# EAGLE design nfc_for_discovery (EAGLE 7.2.0)
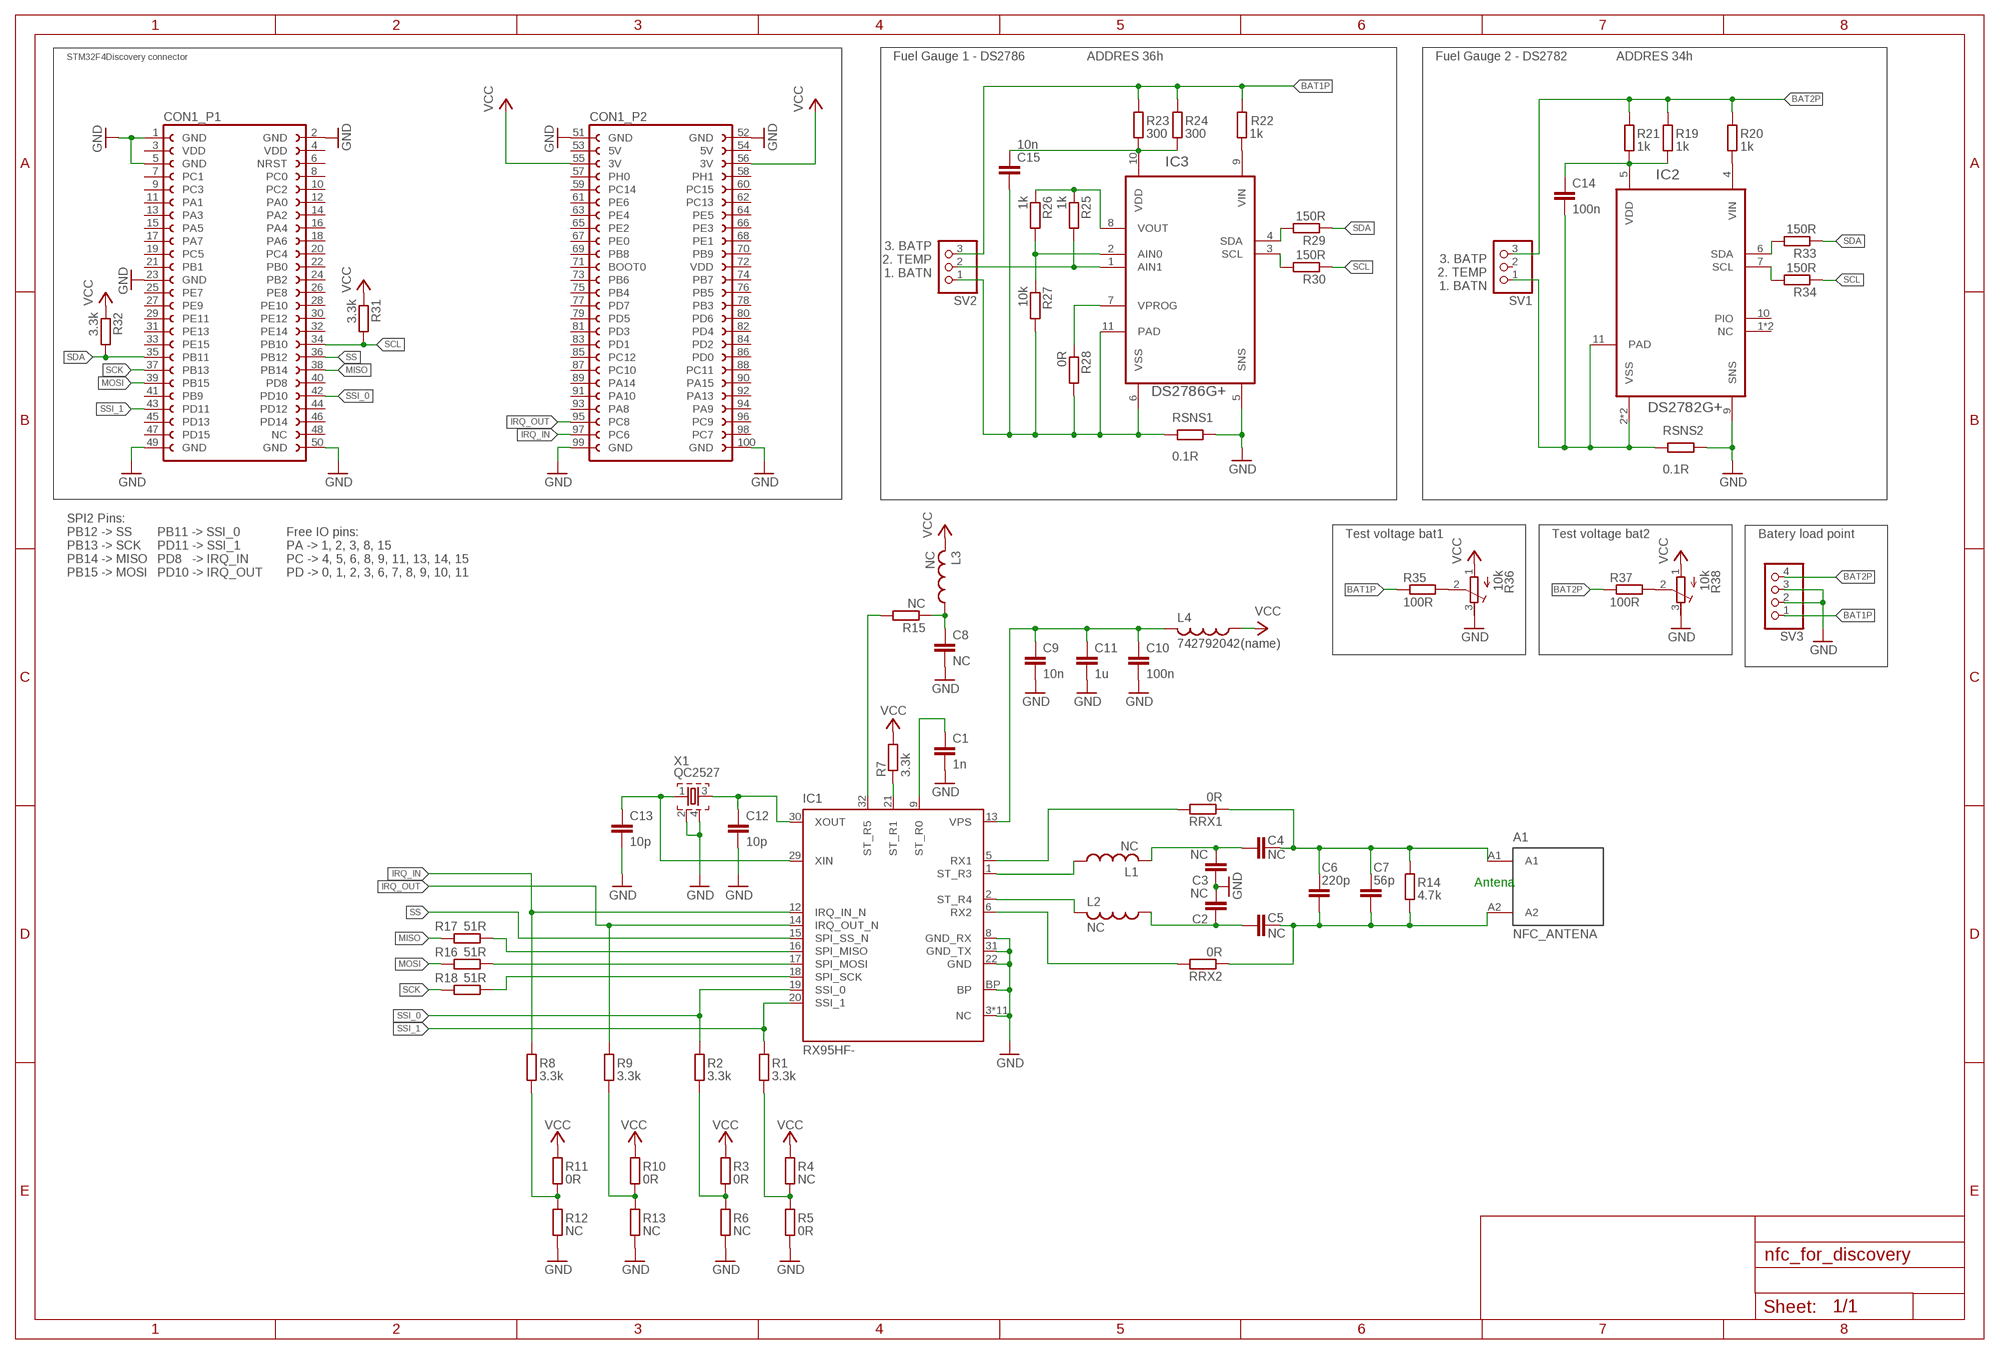
[diagram p0: schematic, sheet 1]

## Parts
A1  NFC_ANTENA  [NFC_ANTENA]
C1  1n  C-EUC0603  [C0603]
C2  NC  C-EUC0603  [C0603]
C3  NC  C-EUC0603  [C0603]
C4  NC  C-EUC0603  [C0603]
C5  NC  C-EUC0603  [C0603]
C6  220p  C-EUC0603  [C0603]
C7  56p  C-EUC0603  [C0603]
C8  NC  C-EUC0603  [C0603]
C9  10n  C-EUC0603  [C0603]
C10  100n  C-EUC0603  [C0603]
C11  1u  C-EUC0603K  [C0603K]
C12  10p  C-EUC0603  [C0603]
C13  10p  C-EUC0603  [C0603]
C14  100n  C-EUC0603  [C0603]
C15  10n  C-EUC0603  [C0603]
CON1  STM32F4DISCOVERY-CONNECTOR  [STM32F4DISCOVERY_CONNECTOR]
IC1  RX95HF-  [VFQFPN32]
IC2  DS2782G+  [DFN300X400]
IC3  DS2786G+  [DFN300X300X80-11N]
L1  NC  L-USL2012C  [L2012C]
L2  NC  L-USL2012C  [L2012C]
L3  NC  L-USL2012C  [L2012C]
L4  742792042(name)  L-USL2012C  [L2012C]
R1  3.3k  R-EU_R0603  [R0603]
R2  3.3k  R-EU_R0603  [R0603]
R3  0R  R-EU_R0603  [R0603]
R4  NC  R-EU_R0603  [R0603]
R5  0R  R-EU_R0603  [R0603]
R6  NC  R-EU_R0603  [R0603]
R7  3.3k  R-EU_R0603  [R0603]
R8  3.3k  R-EU_R0603  [R0603]
R9  3.3k  R-EU_R0603  [R0603]
R10  0R  R-EU_R0603  [R0603]
R11  0R  R-EU_R0603  [R0603]
R12  NC  R-EU_R0603  [R0603]
R13  NC  R-EU_R0603  [R0603]
R14  4.7k  R-EU_R0603  [R0603]
R15  NC  R-EU_R0603  [R0603]
R16  51R  R-EU_R0603  [R0603]
R17  51R  R-EU_R0603  [R0603]
R18  51R  R-EU_R0603  [R0603]
R19  1k  R-EU_R0603  [R0603]
R20  1k  R-EU_R0603  [R0603]
R21  1k  R-EU_R0603  [R0603]
R22  1k  R-EU_R0603  [R0603]
R23  300  R-EU_R0603  [R0603]
R24  300  R-EU_R0603  [R0603]
R25  1k  R-EU_R0603  [R0603]
R26  1k  R-EU_R0603  [R0603]
R27  10k  R-EU_R0603  [R0603]
R28  0R  R-EU_R0603  [R0603]
R29  150R  R-EU_R0603  [R0603]
R30  150R  R-EU_R0603  [R0603]
R31  3.3k  R-EU_R0603  [R0603]
R32  3.3k  R-EU_R0603  [R0603]
R33  150R  R-EU_R0603  [R0603]
R34  150R  R-EU_R0603  [R0603]
R35  100R  R-EU_R0603  [R0603]
R36  10k  R-TRIMM4G/J  [RTRIM4G/J]
R37  100R  R-EU_R0603  [R0603]
R38  10k  R-TRIMM4G/J  [RTRIM4G/J]
RRX1  0R  R-EU_R0603  [R0603]
RRX2  0R  R-EU_R0603  [R0603]
RSNS1  0.1R  R-EU_R0603  [R0603]
RSNS2  0.1R  R-EU_R0603  [R0603]
SV1  PINHD-1X3/90  [1X03/90]
SV2  PINHD-1X3/90  [1X03/90]
SV3  PINHD-1X4/90  [1X04/90]
X1  QC2527  [QC2527]

## Nets
BAT1N: C15.2 IC3.6(VSS) IC3.11(PAD) R27.2 R28.2 RSNS1.2 SV2.1
BAT1P: R22.1 R23.1 R24.1 R35.1 SV2.3 SV3.1
BAT2N: C14.2 IC2.2(VSS) IC2.3(VSS) IC2.11(PAD) RSNS2.2 SV1.1
BAT2P: R19.1 R20.1 R21.1 R37.1 SV1.3 SV3.4
GND: C1.1 C2.2 C3.1 C8.2 C9.2 C10.2 C11.2 C12.2 C13.2 CON1.1(_P1:GND) CON1.2(_P1:GND) CON1.5(_P1:GND) CON1.23(_P1:GND) CON1.49(_P1:GND) CON1.50(_P1:GND) CON1.51(_P2:GND) CON1.52(_P2:GND) CON1.99(_P2:GND) CON1.100(_P2:GND) IC1.3(NC) IC1.4(NC) IC1.7(NC) IC1.8(GND_RX) IC1.10(NC) IC1.11(NC) IC1.22(GND) IC1.23(NC) IC1.24(NC) IC1.25(NC) IC1.26(NC) IC1.27(NC) IC1.28(NC) IC1.31(GND_TX) IC1.BP IC2.9(SNS) IC3.5(SNS) R5.1 R6.1 R12.1 R13.1 R36.3(E) R38.3(E) RSNS1.1 RSNS2.1 SV3.2 SV3.3 X1.2 X1.4
IRQ_IN: CON1.97(_P2:PC6) IC1.12(IRQ_IN_N) R8.2
IRQ_OUT: CON1.95(_P2:PC8) IC1.14(IRQ_OUT_N) R9.2
MISO: CON1.38(_P1:PB14) R17.2
MOSI: CON1.39(_P1:PB15) R16.2
N$1: C14.1 IC2.5(VDD) R19.2 R21.2
N$2: IC1.16(SPI_MISO) R17.1
N$3: IC1.17(SPI_MOSI) R16.1
N$4: IC1.18(SPI_SCK) R18.1
N$5: IC2.4(VIN) R20.2
N$6: IC3.4(SDA) R29.2
N$8: IC3.3(SCL) R30.2
N$9: R1.1 R4.1 R5.2
N$10: R2.1 R3.1 R6.2
N$11: C2.1 C5.2 L2.1
N$12: IC1.21(ST_R1) R7.1
N$13: C1.2 IC1.9(ST_R0)
N$14: R8.1 R11.1 R12.2
N$15: R9.1 R10.1 R13.2
N$16: C3.2 C4.2 L1.2
N$17: A1.A1 C4.1 C6.2 C7.2 R14.1 RRX1.1
N$18: A1.A2 C5.1 C6.1 C7.1 R14.2 RRX2.1
N$19: IC1.6(RX2) RRX2.2
N$20: IC1.5(RX1) RRX1.2
N$21: IC1.1(ST_R3) L1.1
N$22: IC1.2(ST_R4) L2.2
N$23: IC1.32(ST_R5) R15.2
N$24: C8.1 L3.1 R15.1
N$25: C9.1 C10.1 C11.1 IC1.13(VPS) L4.2
N$26: IC3.9(VIN) R22.2
N$27: C12.1 IC1.30(XOUT) X1.3
N$28: C13.1 IC1.29(XIN) X1.1
N$29: C15.1 IC3.10(VDD) R23.2 R24.2
N$30: IC2.6(SDA) R33.2
N$32: IC2.7(SCL) R34.2
N$33: IC3.2(AIN0) R26.2 R27.1
N$34: IC3.1(AIN1) R25.2 SV2.2
N$35: IC3.8(VOUT) R25.1 R26.1
N$36: IC3.7(VPROG) R28.1
N$37: R35.2 R36.2(S)
N$38: R37.2 R38.2(S)
SCK: CON1.37(_P1:PB13) R18.2
SCL: CON1.34(_P1:PB10) R30.1 R31.2 R34.1
SDA: CON1.35(_P1:PB11) R29.1 R32.2 R33.1
SS: CON1.36(_P1:PB12) IC1.15(SPI_SS_N)
SSI_0: CON1.42(_P1:PD10) IC1.19(SSI_0) R2.2
SSI_1: CON1.43(_P1:PD11) IC1.20(SSI_1) R1.2
VCC: CON1.55(_P2:3V) CON1.56(_P2:3V) L3.2 L4.1 R3.2 R4.2 R7.2 R10.2 R11.2 R31.1 R32.1 R36.1(A) R38.1(A)
Unconnected: CON1.3(_P1:VDD) CON1.4(_P1:VDD) CON1.6(_P1:NRST) CON1.7(_P1:PC1) CON1.8(_P1:PC0) CON1.9(_P1:PC3) CON1.10(_P1:PC2) CON1.11(_P1:PA1) CON1.12(_P1:PA0) CON1.13(_P1:PA3) CON1.14(_P1:PA2) CON1.15(_P1:PA5) CON1.16(_P1:PA4) CON1.17(_P1:PA7) CON1.18(_P1:PA6) CON1.19(_P1:PC5) CON1.20(_P1:PC4) CON1.21(_P1:PB1) CON1.22(_P1:PB0) CON1.24(_P1:PB2) CON1.25(_P1:PE7) CON1.26(_P1:PE8) CON1.27(_P1:PE9) CON1.28(_P1:PE10) CON1.29(_P1:PE11) CON1.30(_P1:PE12) CON1.31(_P1:PE13) CON1.32(_P1:PE14) CON1.33(_P1:PE15) CON1.40(_P1:PD8) CON1.41(_P1:PB9) CON1.44(_P1:PD12) CON1.45(_P1:PD13) CON1.46(_P1:PD14) CON1.47(_P1:PD15) CON1.48(_P1:NC) CON1.53(_P2:5V) CON1.54(_P2:5V) CON1.57(_P2:PH0) CON1.58(_P2:PH1) CON1.59(_P2:PC14) CON1.60(_P2:PC15) CON1.61(_P2:PE6) CON1.62(_P2:PC13) CON1.63(_P2:PE4) CON1.64(_P2:PE5) CON1.65(_P2:PE2) CON1.66(_P2:PE3) CON1.67(_P2:PE0) CON1.68(_P2:PE1) CON1.69(_P2:PB8) CON1.70(_P2:PB9) CON1.71(_P2:BOOT0) CON1.72(_P2:VDD) CON1.73(_P2:PB6) CON1.74(_P2:PB7) CON1.75(_P2:PB4) CON1.76(_P2:PB5) CON1.77(_P2:PD7) CON1.78(_P2:PB3) CON1.79(_P2:PD5) CON1.80(_P2:PD6) CON1.81(_P2:PD3) CON1.82(_P2:PD4) CON1.83(_P2:PD1) CON1.84(_P2:PD2) CON1.85(_P2:PC12) CON1.86(_P2:PD0) CON1.87(_P2:PC10) CON1.88(_P2:PC11) CON1.89(_P2:PA14) CON1.90(_P2:PA15) CON1.91(_P2:PA10) CON1.92(_P2:PA13) CON1.93(_P2:PA8) CON1.94(_P2:PA9) CON1.96(_P2:PC9) CON1.98(_P2:PC7) IC2.1(NC) IC2.8(NC) IC2.10(PIO) SV1.2

## Notes on the sheet
- STM32F4Discovery connector | Fuel Gauge 1 - DS2786 | ADDRES 36h | Fuel Gauge 2 - DS2782 | ADDRES 34h
- 3. BATP
  2. TEMP
  1. BATN
- 3. BATP
  2. TEMP
  1. BATN
- Test voltage bat1 | Test voltage bat2 | Batery load point
- SPI2 Pins:
  PB12 -> SS
  PB13 -> SCK
  PB14 -> MISO
  PB15 -> MOSI
- PB11 -> SSI_0
  PD11 -> SSI_1
  PD8   -> IRQ_IN
  PD10 -> IRQ_OUT
- Free IO pins:
  PA -> 1, 2, 3, 8, 15
  PC -> 4, 5, 6, 8, 9, 11, 13, 14, 15
  PD -> 0, 1, 2, 3, 6, 7, 8, 9, 10, 11
- Antena

## Library data of the parts
A1 = NFC_antena_for_RX59HF:NFC_ANTENA
C1-C15 = rcl:C-EU: CAPACITOR, European symbol
CON1 = stm32f4Discovery_connector:STM32F4DISCOVERY-CONNECTOR
IC1 = RX95HF:RX95HF
IC2 = DS278x:DS2782G+
IC3 = DS278x:DS2786G+; DESCRIPTION: Stand-Alone OCV-Based Fuel Gauge; MPN: DS2786; PACKAGE: DFN-10; SUPPLIER: Maxim
L1-L4 = rcl:L-US: INDUCTOR, American symbol
R1-R35 R37 RRX1 RRX2 RSNS1 RSNS2 = rcl:R-EU_: RESISTOR, European symbol
R36 R38 = rcl:R-TRIMM: Trimm resistor
SV1 SV2 = pinhead:PINHD-1X3: PIN HEADER
SV3 = pinhead:PINHD-1X4: PIN HEADER
X1 = QCxxxx:QC2527

## Board
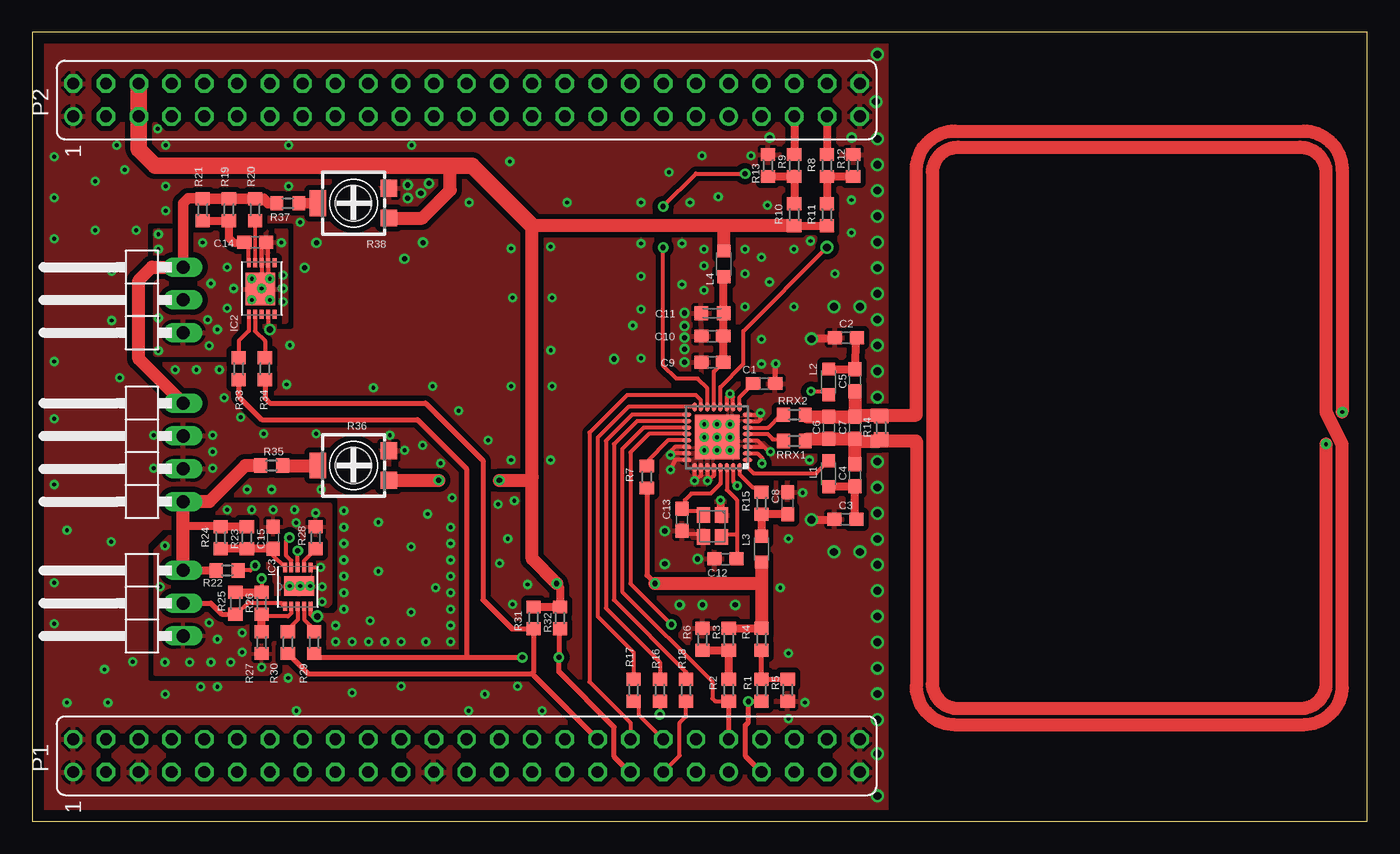
[diagram p1: board, top side]
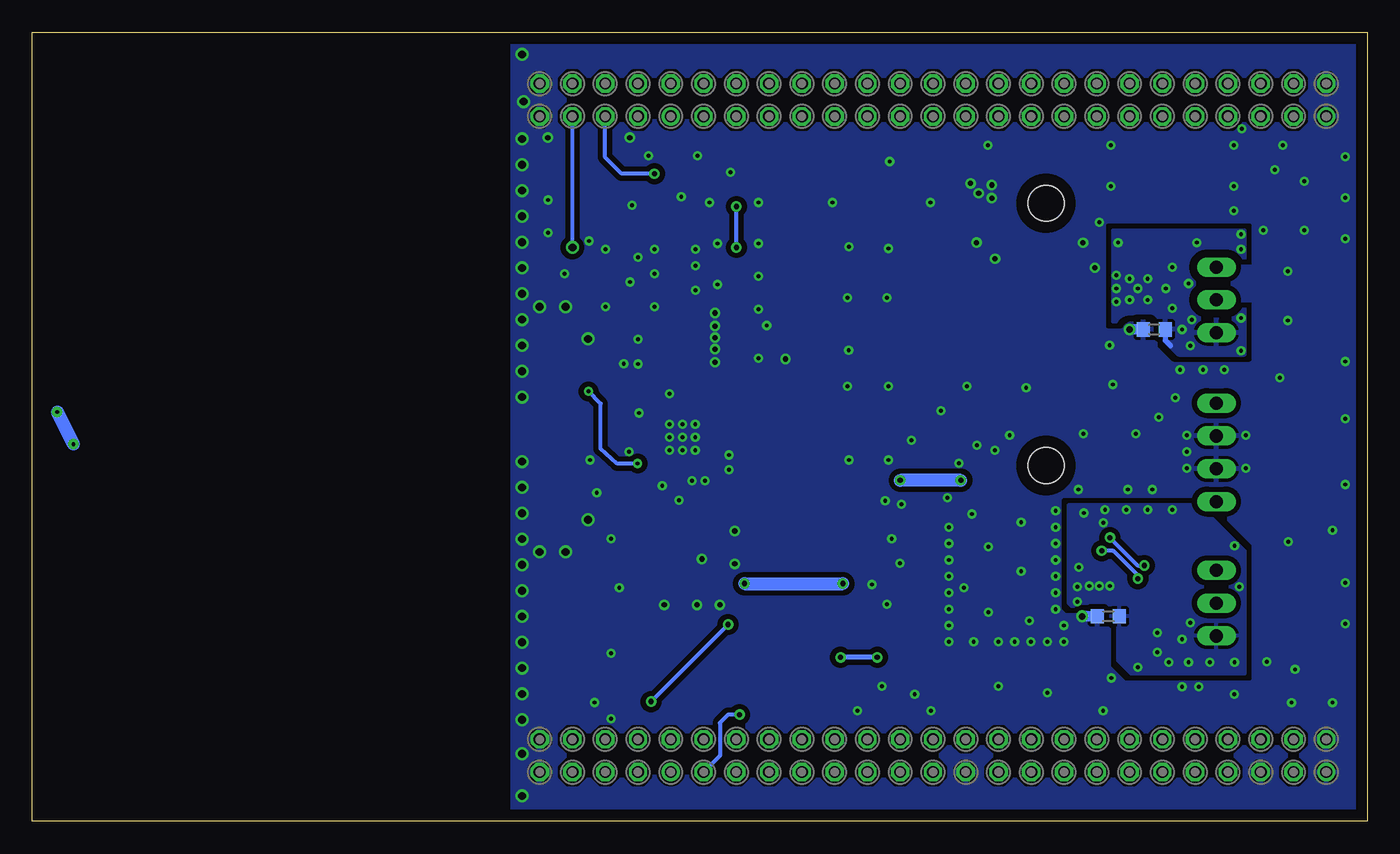
[diagram p2: board, bottom side, seen from below]

Size 103.46 x 61.12 mm. Coordinates in mm from the lower left corner, seen from the top.
Outline: 0,0 103.46,0 103.46,61.12 0,61.12 0,0
Copper layers (1*16): Top 0.035mm / dielectric 1.5mm / Bottom 0.035mm
Design rules "default *": minimum track width 8mil, minimum drill 0.3mm, track to track 4mil, track to pad 4mil, pad to pad 4mil, via to via 4mil, smd to smd 0mil, copper to edge 35mil, drill to drill 8mil, minimum pad ring 10mil, minimum via ring 8mil, stop-mask expansion 4mil, vias tented up to drill 0mil, thermal gap 10mil
Holes 2.8 mm at 24.89,47.88 24.89,27.56

### Footprints (pad centres in the part's own frame; a part is rotated, then mirrored left to right if it is on the bottom)
NFC_ANTENA = smd 1.27 x 1 bottom: A1 0.237,1.025; A2 0.237,-0.988 | drill 0.3: P$3 34.862,1.262; P$4 36.125,-1.225
C0603 = smd 1.1 x 1: 1 -0.85,0; 2 0.85,0
C0603K = smd 1.05 x 1.08: 1 -0.875,0; 2 0.875,0
STM32F4DISCOVERY_CONNECTOR = drill 0.914: 1 -1.27,30.48; 41 -1.27,-20.32; 51 49.53,30.48; 91 49.53,-20.32 | drill 0.914 octagon: 2 1.27,30.48; 3 -1.27,27.94; 4 1.27,27.94; 5 -1.27,25.4; 6 1.27,25.4; 7 -1.27,22.86; 8 1.27,22.86; 9 -1.27,20.32; 10 1.27,20.32; 11 -1.27,17.78; 12 1.27,17.78; 13 -1.27,15.24; 14 1.27,15.24; 15 -1.27,12.7; 16 1.27,12.7; 17 -1.27,10.16; 18 1.27,10.16; 19 -1.27,7.62; 20 1.27,7.62; 21 -1.27,5.08; 22 1.27,5.08; 23 -1.27,2.54; 24 1.27,2.54; 25 -1.27,0; 26 1.27,0; 27 -1.27,-2.54; 28 1.27,-2.54; 29 -1.27,-5.08; 30 1.27,-5.08; 31 -1.27,-7.62; 32 1.27,-7.62; 33 -1.27,-10.16; 34 1.27,-10.16; 35 -1.27,-12.7; 36 1.27,-12.7; 37 -1.27,-15.24; 38 1.27,-15.24; 39 -1.27,-17.78; 40 1.27,-17.78; 42 1.27,-20.32; 43 -1.27,-22.86; 44 1.27,-22.86; 45 -1.27,-25.4; 46 1.27,-25.4; 47 -1.27,-27.94; 48 1.27,-27.94; 49 -1.27,-30.48; 50 1.27,-30.48; 52 52.07,30.48; 53 49.53,27.94; 54 52.07,27.94; 55 49.53,25.4; 56 52.07,25.4; 57 49.53,22.86; 58 52.07,22.86; 59 49.53,20.32; 60 52.07,20.32; 61 49.53,17.78; 62 52.07,17.78; 63 49.53,15.24; 64 52.07,15.24; 65 49.53,12.7; 66 52.07,12.7; 67 49.53,10.16; 68 52.07,10.16; 69 49.53,7.62; 70 52.07,7.62; 71 49.53,5.08; 72 52.07,5.08; 73 49.53,2.54; 74 52.07,2.54; 75 49.53,0; 76 52.07,0; 77 49.53,-2.54; 78 52.07,-2.54; 79 49.53,-5.08; 80 52.07,-5.08; 81 49.53,-7.62; 82 52.07,-7.62; 83 49.53,-10.16; 84 52.07,-10.16; 85 49.53,-12.7; 86 52.07,-12.7; 87 49.53,-15.24; 88 52.07,-15.24; 89 49.53,-17.78; 90 52.07,-17.78; 92 52.07,-20.32; 93 49.53,-22.86; 94 52.07,-22.86; 95 49.53,-25.4; 96 52.07,-25.4; 97 49.53,-27.94; 98 52.07,-27.94; 99 49.53,-30.48; 100 52.07,-30.48
VFQFPN32 = smd 0.7 x 0.3: 1 -2.35,1.75; 2 -2.35,1.25; 3 -2.35,0.75; 4 -2.35,0.25; 5 -2.35,-0.25; 6 -2.35,-0.75; 7 -2.35,-1.25; 8 -2.35,-1.75; 17 2.35,-1.75; 18 2.35,-1.25; 19 2.35,-0.75; 20 2.35,-0.25; 21 2.35,0.25; 22 2.35,0.75; 23 2.35,1.25; 24 2.35,1.75 | smd 0.3 x 0.7: 9 -1.75,-2.35; 10 -1.25,-2.35; 11 -0.75,-2.35; 12 -0.25,-2.35; 13 0.25,-2.35; 14 0.75,-2.35; 15 1.25,-2.35; 16 1.75,-2.35; 25 1.75,2.35; 26 1.25,2.35; 27 0.75,2.35; 28 0.25,2.35; 29 -0.25,2.35; 30 -0.75,2.35; 31 -1.25,2.35; 32 -1.75,2.35 | smd 3.45 x 3.45: BP 0,0
DFN300X400 = smd 0.711 x 0.305: 1 -1.999,0.991; 2 -1.999,0.508; 3 -1.999,0; 4 -1.999,-0.508; 5 -1.999,-0.991; 6 1.999,-0.991; 7 1.999,-0.508; 8 1.999,0; 9 1.999,0.508; 10 1.999,0.991 | smd 2.499 x 2.311: 11 0.051,-0.102
DFN300X300X80-11N = smd 0.711 x 0.305: 1 -1.499,0.991; 2 -1.499,0.508; 3 -1.499,0; 4 -1.499,-0.508; 5 -1.499,-0.991; 6 1.499,-0.991; 7 1.499,-0.508; 8 1.499,0; 9 1.499,0.508; 10 1.499,0.991 | smd 1.499 x 2.311: 11 0.051,-0.102
L2012C = smd 1 x 1: 1 -1,0; 2 1,0
R0603 = smd 1 x 1.1: 1 -0.85,0; 2 0.85,0
RTRIM4G/J = smd 1.3 x 1.3: 1 -1.15,-2.75; 3 1.15,-2.75 | smd 2 x 1.3: 2 0,2.75
1X03/90 = drill 1.016 long: 1 -2.54,-3.81; 2 0,-3.81; 3 2.54,-3.81
1X04/90 = drill 1.016 long: 1 -3.81,-3.81; 2 -1.27,-3.81; 3 1.27,-3.81; 4 3.81,-3.81
QC2527 = smd 1.2 x 1: 1 -0.85,-0.7; 2 0.85,-0.7; 3 0.85,0.7; 4 -0.85,0.7

### Placement (x,y rotation side)
A1  65.41,30.48 180 bottom
C1  56.72,33.91 180 top
C2  63.06,37.46 180 top
C3  63.02,23.39 0 top
C4  63.75,26.8 270 top
C5  63.75,34.16 90 top
C6  61.72,30.48 270 top
C7  63.75,30.48 270 top
C8  58.55,24.64 90 top
C9  52.7,35.56 180 top
C10  52.7,37.59 180 top
C11  52.7,39.37 180 top
C12  53.72,20.32 180 top
C13  50.35,23.35 270 top
C14  17.29,44.85 0 top
C15  18.67,21.97 90 top
CON1  33.66,5.08 90 top
IC1  53.08,29.75 180 top
IC2  17.78,41.27 270 top
IC3  20.57,18.16 90 top
L1  61.72,26.92 270 top
L2  61.72,34.04 270 top
L3  56.52,21.08 270 top
L4  53.59,43.18 270 top
R1  56.52,10.16 270 top
R2  53.98,10.16 270 top
R3  53.98,14.1 90 top
R4  56.52,14.1 90 top
R5  58.55,10.16 90 top
R6  51.94,14.1 270 top
R7  47.62,26.67 270 top
R8  61.59,50.8 90 top
R9  59.05,50.8 90 top
R10  59.05,46.99 270 top
R11  61.59,46.99 270 top
R12  63.63,50.8 270 top
R13  57.02,50.8 270 top
R14  65.79,30.48 90 top
R15  56.52,24.64 90 top
R16  48.64,10.16 270 top
R17  46.61,10.16 270 top
R18  50.67,10.16 270 top
R19  15.24,47.37 270 top
R20  17.27,47.37 270 top
R21  13.21,47.37 270 top
R22  15.11,19.43 0 top
R23  16.64,21.97 270 top
R24  14.61,21.97 270 top
R25  15.75,16.89 270 top
R26  17.78,16.89 270 top
R27  17.78,13.84 270 top
R28  21.97,21.97 90 top
R29  21.84,13.84 90 top
R30  19.81,13.84 90 top
R31  38.86,15.75 270 top
R32  40.89,15.75 270 top
R33  16,35.05 90 top
R34  18.03,35.05 90 top
R35  18.54,27.56 0 top
R36  24.89,27.56 90 top
R37  19.81,47.88 0 top
R38  24.89,47.88 90 top
RRX1  59.05,29.46 180 top
RRX2  59.05,31.5 180 top
RSNS1  20.07,15.88 0 bottom
RSNS2  16.51,38.1 0 bottom
SV1  7.87,40.39 90 top
SV2  7.87,16.89 90 top
SV3  7.87,28.57 90 top
X1  52.7,22.86 270 top

### Tracks (layer width: path | path; a pad name or v marks a point on that pad's centre or on a via)
BAT1N  (via drill 0.3)
  Top 0.305: v21.55,18.23 21.61,18.23 21.64,18.26 | IC3.6 22.33,19.66 v22.35,19.68
  other vias: 18.67,24.13 20.75,18.23 19.95,18.23 21.97,23.88 22.48,18.16 22.48,17.02 16.26,13.08 17.78,11.94 15.11,24.13 17.02,24.13 20.32,24.13 20.45,23.11 10.29,12.32 12.19,12.32 15.37,12.32 9.91,18.16 10.29,21.34 13.72,15.37 14.35,14.1 13.84,12.32 16.26,14.61
  pour Top (isolate 0.406): 23.11,24.51 13.08,24.51 9.53,20.95 9.53,11.43 18.29,11.43 19.3,12.45 19.3,14.99 20.57,16.26 22.48,16.26 23.11,16.89
  pour Bottom (isolate 0.406): 23.11,24.51 13.08,24.51 9.53,20.95 9.53,11.43 18.29,11.43 19.3,12.45 19.3,14.99 20.57,16.26 22.48,16.26 23.11,16.89
BAT1P
  Top 0.61: R23.1 R24.1 14.57,22.86 11.68,22.86 | SV2.3 R22.1
  Top 1.016: SV2.3 11.68,22.86 SV3.1 13.72,24.77 16.51,27.56 R35.1
BAT2N  (via drill 0.3)
  Top 0.305: 17.78,42.04 IC2.3 17.78,45.09 | 17.78,41.91 17.78,42.04 | 17.78,42.04 v18.41,42.04 18.29,42.04 IC2.2 18.29,45.09 18.41,45.09
  Bottom 0.406: RSNS2.2 15.66,37.25 15.24,36.83
  other vias: 17.78,41.27 17.02,40.39 17.02,42.04 18.41,40.39 19.3,44.83 19.43,40.26 19.43,41.27 19.43,42.29 14.35,38.1 13.72,36.83 13.84,41.66 13.21,44.83 15.11,42.93 15.11,39.75 15.62,41.27 13.59,38.86 9.78,38.99 9.78,36.45 9.78,45.47 9.78,44.32
  pour Top (isolate 0.406): 9.53,36.2 15.88,36.2 15.88,38.73 19.68,38.73 19.68,45.72 9.53,45.72
  pour Bottom (isolate 0.61): 9.53,36.2 9.53,45.72 19.68,45.72 19.68,38.73 15.88,38.73 15.88,37.47 14.61,36.2
BAT2P
  Top 0.813: SV1.3 11.68,47.88 12.06,48.26 13.17,48.26 R21.1 R19.1 R20.1 17.95,48.22 18.29,47.88 R37.1
  Top 1.016: SV3.4 8.26,35.81 8.26,41.91 9.27,42.93 SV1.3
GND  (via drill 0.3, 0.4, 0.5, 0.6)
  Top 0.305: 54.35,26.35 v54.64,26 | 54.58,25.93 v54.64,26 | IC1.31 54.33,26.31 v54.64,26 | IC1.11 53.83,32.88 v54.08,33.12 54.33,32.88 IC1.10 | IC1.8 56.33,31.5 v56.45,31.62 56.45,31.12 56.33,31 IC1.7 | IC1.4 56.2,29.5 56.7,29 | 56.7,29 57.2,28.5 v57.2,28.63 | IC1.3 56.7,29 | v53.08,28.75 v54.08,28.75 | IC1.27 v52.33,26.38 52.83,26.75 IC1.28 | IC1.25 v51.33,26.38 51.83,26.75 IC1.26 | IC1.22 49.83,29 49.53,28.7 49.53,28.37 v49.45,28.37 49.58,28.5 IC1.23 | IC1.24 49.83,28 v49.45,27.24 | 50.38,22.52 C13.2 50.35,22.23 52.07,22.23 52.07,22.01 X1.2 | X1.4 53.34,23.58 53.34,23.88 | IC2.9 18.29,38.23 v18.41,38.1 | v22.1,15.88 21.72,15.88 21.57,16.03 IC3.5
  Top 0.406: C1.1 57.61,33.91 v57.61,35.44
  Top 0.61: 60.41,37.39 v60.39,37.36 62.11,37.36 C2.2 | v60.39,23.36 60.87,23.34 62.12,23.34 C3.1 | v53.34,24.85 53.34,23.88 | 53.34,23.88 53.34,23.88 arc-90 53.34,23.88
  Bottom 0.813: RSNS2.1 v18.41,38.1 | RSNS1.1 v22.1,15.88
  other vias: 62.14,39.86 64.14,39.86 65.5,38.86 65.5,36.86 65.5,34.86 65.5,32.86 65.5,27.86 65.5,25.86 65.5,23.86 65.5,21.86 62.14,20.86 64.14,20.86 41.46,47.93 53.08,29.75 52.08,28.75 52.08,29.75 52.08,30.75 53.08,30.75 54.08,30.75 54.08,29.75 50.55,39.37 50.55,37.47 50.55,35.56 50.55,36.58 50.55,38.35 63.5,52.96 57.15,52.96 51.94,16.76 50.16,16.76 54.48,16.76 45.09,35.81 51.56,20.32 65.5,19.86 65.5,17.86 65.5,15.86 65.5,13.86 65.5,11.86 65.5,9.86 65.5,7.86 65.5,5.23 65.5,1.96 65.5,59.4 65.38,55.75 65.5,52.86 65.5,50.86 65.5,48.86 65.5,46.86 65.5,44.86 65.5,42.86 65.5,40.86 30.29,44.82 28.84,43.57 22.04,44.81 21.11,42.88 6.12,21.64 5.6,11.76 56.5,43.68 53.16,48.37 13.06,10.43 14.35,10.43 27.71,29.89 28.85,28.75 31.65,27.74 32.54,25.07 30.25,29.13 22,30.02 17.93,30.02 14.88,32.82 16.15,31.29 14.5,34.98 11.07,34.98 12.72,34.98 32.41,13.89 32.41,15.16 32.41,16.43 32.41,17.7 32.41,18.97 32.41,20.24 32.41,21.51 32.41,22.78 23.52,13.89 24.79,13.89 26.06,13.89 27.33,13.89 28.6,13.89 30.5,13.89 24.15,24.05 24.15,22.78 24.15,21.51 24.15,20.24 24.15,18.97 24.15,17.7 24.15,16.43 23.52,15.16 16.66,25.7 18.57,25.7 22.38,25.7 26.82,23.16 29.36,21.26 31.27,18.08 26.19,15.54 26.82,19.35 29.36,16.18 30.63,23.8 19.84,11.1 28.6,10.46 37.62,10.46 39.52,8.56 35.08,9.83 33.81,8.56 24.79,9.96 20.47,8.56 10.31,9.83 5.87,9.19 7.77,12.37 2.69,9.19 2.69,22.53 13.99,28.62 13.99,29.89 13.99,27.36 9.42,27.36 9.42,29.89 19.71,33.83 19.96,36.88 26.44,33.58 31.01,33.7 33.04,31.8 35.33,29.51 37.11,27.99 37.11,33.7 37.23,40.56 37.11,44.37 40.16,44.5 40.28,40.56 40.28,33.7 40.16,27.99 36.09,24.56 37.36,24.82 36.85,21.89 36.22,19.99 37.23,16.81 38.38,18.34 29.1,49.29 29.1,48.27 30.75,49.42 30.11,48.65 60.22,27.99 49.02,22.48 49.02,19.94 59.71,25.45 47.17,47.93 47.17,44.76 50.35,44.76 50.98,47.93 47.17,42.22 50.35,41.58 46.54,38.41 47.17,35.87 47.17,39.68 40.19,36.5 37.02,51.11 33.84,47.93 19.87,49.2 19.87,52.38 10.35,52.38 9.71,53.65 29.39,52.38 10.35,49.2 10.35,47.3 6.54,52.38 7.17,50.47 20.76,46.41 6.79,34.34 6.15,38.79 6.15,42.6 8.06,45.77 1.71,35.61 1.71,45.14 4.88,45.77 1.71,48.31 1.71,51.49 4.88,49.58 1.71,31.17 1.71,26.09 1.71,18.47 1.71,15.29 60.31,44.95 55.23,39.87 55.23,44.31 57.13,41.77 59.04,44.31 55.23,42.41 52.05,44.31 52.05,41.14 52.05,43.05 56.5,37.33 56.5,35.42 59.04,39.87 62.22,42.41 63.48,45.59 63.48,48.12 56.97,47.73 55.7,51.55 51.89,51.55 49.35,50.27 59.88,9.2 58.6,7.93 58.6,13.01 58.6,21.9 57.97,18.09
  pour Bottom (isolate 0.406, rank 2): 0,0 66.2,0 66.2,36.7 66.2,61.1 0,61.1
  pour Top (isolate 0.406, rank 2): 0,0 66.2,0 66.2,61.1 0,61.1
IRQ_IN  (via drill 0.6)
  Top 0.305: IC1.12 53.33,33.64 55.12,35.43 55.12,37.97 v61.59,44.45
  Top 0.61: CON1.97 R8.2
  Bottom 0.305: v61.59,44.45 CON1.97
IRQ_OUT  (via drill 0.4)
  Top 0.305: IC1.14 52.33,33.53 51.56,34.29 49.91,34.29 48.9,35.31 v48.9,44.45 | v48.9,47.62 51.44,50.16 v55.24,50.16
  Top 0.61: CON1.95 R9.2
  Bottom 0.305: v48.9,44.45 v48.9,47.62 | v55.24,50.16 57.78,50.16 59.05,51.44 CON1.95
MISO
  Top 0.305: R17.2 46.99,9.06 46.99,8.26 CON1.38
MOSI  (via drill 0.4)
  Top 0.305: R16.2 v48.64,8.26
  Bottom 0.305: v48.64,8.26 49.53,8.26 50.16,7.62 50.16,5.08 CON1.39
N$1
  Top 0.305: IC2.5 16.79,44.85 C14.1
  Top 0.61: R21.2 R19.2 15.24,45.21 15.62,44.83 16.42,44.83 C14.1
N$2
  Top 0.305: IC1.16 46.2,32.1 43.81,29.72 43.81,15.88 46.61,13.08 R17.1
N$3
  Top 0.305: IC1.17 46.49,31.5 44.45,29.46 44.45,16.51 48.64,12.32 R16.1
N$4
  Top 0.305: IC1.18 46.88,31 45.09,29.21 45.09,17.14 50.67,11.56 R18.1
N$5
  Top 0.254: IC2.4 R20.2
N$6
  Top 0.305: IC3.4 21.08,15.62 21.84,14.86 R29.2
N$8
  Top 0.305: IC3.3 20.57,15.62 19.94,14.99 19.94,14.82 R30.2
N$9
  Top 0.406: R4.1 R1.1 R5.2
N$10
  Top 0.61: R6.2 R3.1 R2.1
N$11
  Top 0.61: C2.1 63.87,37.42 C5.2 61.74,35.01 L2.1
N$12
  Top 0.305: IC1.21 49.26,29.5 47.62,27.87 R7.1
N$13
  Top 0.305: 55.99,33.75 C1.2 54.83,32.86 IC1.9
N$14
  Top 0.61: R12.2 R8.1 R11.1
N$15
  Top 0.61: R10.1 R9.1 59.05,50.16 58.84,49.95 R13.2
N$16
  Top 0.61: 63.73,25.92 C4.2 63.75,23.39 C3.2 | 63.73,25.92 L1.2 | 63.73,25.92 63.74,25.54
N$17
  Top 1: C4.1 C7.2
  Top 1.016: RRX1.1 60.07,29.63 C6.2 C7.2 63.93,29.45 A1.A1 65.79,29.6 R14.1
N$18
  Top 1.016: C5.1 C7.1 | RRX2.1 60.07,31.33 C6.1 C7.1 | C7.1 63.89,31.47 A1.A2 R14.2
N$19
  Top 0.305: IC1.6 57.04,30.5 58.04,31.5 RRX2.2
N$20
  Top 0.305: IC1.5 56.99,30 57.4,29.59 58.08,29.59 RRX1.2
N$21
  Top 0.305: IC1.1 55.42,27.43 55.91,26.95 60.74,26.95 L1.1
N$22  (via drill 0.3)
  Top 0.305: IC1.2 56.2,28.5 56.58,28.12 56.58,27.62 v56.54,27.71 | v60.35,33.3 62.02,33.3 L2.2
  Bottom 0.305: v56.54,27.71 58.13,27.71 59.4,28.86 59.4,32.35 v60.35,33.3
N$23
  Top 0.305: 56.54,25.15 R15.2 56.46,25.7 55.83,25.88 54.83,26.88 IC1.32
N$24
  Top 0.61: C8.1 R15.1 L3.1
N$25
  Top 0.305: IC1.13 52.83,34.83 C9.1
  Top 0.61: C9.1 C10.1 53.55,39.34 C11.1 53.58,42.17 L4.2
N$26  (via drill 0.4)
  Top 0.305: IC3.9 20.07,20.19 19.68,20.57 19.68,21.72 v19.94,21.97 | v17.27,19.81 16.89,19.43 R22.2
  Bottom 0.305: v19.94,21.97 17.78,19.81 v17.27,19.81
N$27
  Top 0.305: IC1.30 53.83,25.68 54.61,24.89 54.61,22.23 | 54.61,22.23 54.61,20.61 C12.1 | 54.61,22.23 53.71,22.23 53.71,22.01 X1.3
N$28
  Top 0.305: C13.1 50.1,23.95 | IC1.29 53.33,26.18 53.35,26.16 52.58,25.38 51.08,25.38 50.58,24.88 50.58,24.02 | C13.1 50.5,24.2 50.73,23.98 | 50.73,23.98 50.05,24 | 50.58,24.02 50.1,24 | 50.58,24.02 50.05,24 | 50.73,23.98 50.05,23.98 50.05,24 | X1.1 52.07,23.71 52.07,24 50.35,24 C13.1
N$29
  Top 0.305: 18.88,21.12 C15.1 18.67,20.57 IC3.10
  Top 0.61: C15.1 R23.2 R24.2
N$30
  Top 0.305: IC2.6 16.79,38 16,37.21 R33.2
N$32
  Top 0.305: IC2.7 17.27,37.97 18.03,37.21 R34.2
N$33
  Top 0.305: IC3.2 20.07,16.13 19.81,15.88 17.95,15.88 R26.2
  Top 0.61: R27.1 R26.2
N$34
  Top 0.305: IC3.1 19.53,16.66 19.3,16.89 16.73,16.89 R25.2
  Top 0.406: SV2.2 13.84,16.89 14.69,16.04 R25.2
N$35  (via drill 0.4)
  Top 0.305: IC3.8 v20.57,20.95 | v17.78,18.8 R26.1
  Top 0.61: R25.1 R26.1
  Bottom 0.305: v17.78,18.8 17.78,19.05 19.68,20.95 v20.57,20.95
N$36
  Top 0.305: IC3.7 21.08,20.19 21.97,21.08 R28.1
N$37
  Top 1.016: R35.2 R36.2
N$38
  Top 0.813: R37.2 R38.2
SCK
  Top 0.305: CON1.37 50.16,5.08 50.16,7.62 50.67,8.13 R18.2
SCL
  Top 0.406: CON1.34 38.85,11.31 arc90 38.73,11.43 | R30.1 21.38,11.43 38.73,11.43 | R34.1 18.03,32.77 18.41,32.38 30.48,32.38 34.92,27.94 34.92,17.14 37.17,14.9 R31.2 38.86,11.56 38.73,11.43
SDA  (via drill 0.4)
  Top 0.305: CON1.35 46.29,3.81 | 22.1,12.93 R29.1 | 40.82,14.8 R32.2
  Top 0.406: 46.29,3.81 45.1,5 45.1,7.3 40.82,11.58 v40.82,12.7 40.82,14.8 arc-90 R32.2 | 22.1,12.93 22.32,12.7 33.66,12.7 | 33.66,12.7 v37.97,12.7 | R33.1 16,32.89 17.78,31.11 29.84,31.11 33.66,27.3 33.66,12.7
  Bottom 0.406: v37.97,12.7 v40.82,12.7
SS
  Top 0.305: IC1.15 51.83,32.63 51.44,33.02 46.1,33.02 43.18,30.1 43.18,10.79 46.35,7.62 CON1.36
SSI_0
  Top 0.305: IC1.19 47.39,30.5 45.72,28.83 45.72,17.78 52.7,10.79 52.7,9.53 52.92,9.31 R2.2
  Top 0.406: R2.2 CON1.42
SSI_1  (via drill 0.4)
  Top 0.305: IC1.20 47.78,30 46.35,28.57 46.35,18.41 v49.53,15.24
  Top 0.406: CON1.43 55.24,5.08 55.24,7.41 55.5,7.66 v55.5,9.27 55.54,9.31 R1.2
  Bottom 0.305: v49.53,15.24 v55.5,9.27
VCC  (via drill 0.4)
  Top 0.305: 40.85,18.2 v40.64,18.41
  Top 0.406: R7.2 47.62,19.05 v48.26,18.41
  Top 0.61: R10.2 R11.2 | R3.2 R4.2 | R31.1 R32.1 40.89,18.16 40.85,18.2
  Top 1.016: R10.2 53.34,46.14 | 53.34,46.14 38.73,46.14 38.73,26.67 | L4.1 53.59,45.89 53.34,46.14 | L3.2 56.52,18.41 | 56.52,18.41 R4.2 | 56.52,18.41 v48.26,18.41 | v40.64,18.41 38.73,20.32 38.73,26.67 | R36.1 31.23,26.41 v31.5,26.42 | v36.2,26.42 38.48,26.42 38.73,26.67 | R38.1 30.22,46.73 32.38,48.9 32.38,50.8
  Top 1.27: 38.73,46.14 34.08,50.8 32.38,50.8 9.53,50.8 8.26,52.07 CON1.55 CON1.56
  Bottom 1.016: v48.26,18.41 v40.64,18.41 | v31.5,26.42 v36.2,26.42